# Altium schematic sheet gateway.SchDoc
size A
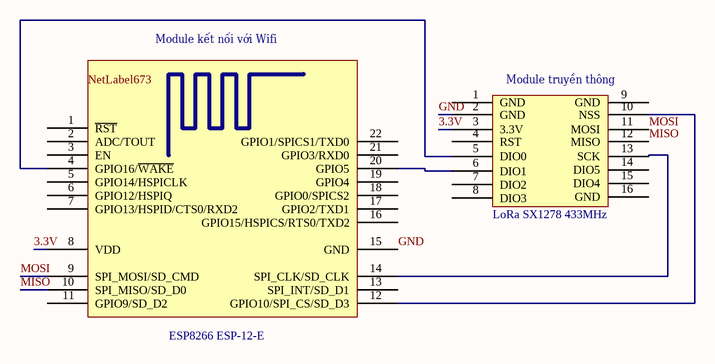
[diagram p0: gateway.SchDoc]

## Parts
Module_kết_nối_với_Wifi  ESP8266 ESP-12-E  [ESP8266 ESP-12-E]
Module_truyền_thông  LoRa SX1278 433MHz  [PCBLoRa]

## Nets
3.3V: Module_kết_nối_với_Wifi.8(VDD) Module_truyền_thông.3(3.3V)
GND: Module_kết_nối_với_Wifi.15(GND) Module_truyền_thông.2(GND)
MISO: Module_kết_nối_với_Wifi.10(SPI_MISO/SD_D0) Module_truyền_thông.12(MISO)
MOSI: Module_kết_nối_với_Wifi.9(SPI_MOSI/SD_CMD) Module_truyền_thông.11(MOSI)
NetModule_kết_nối_với_Wifi_4: Module_kết_nối_với_Wifi.4(GPIO16/~{WAKE}) Module_truyền_thông.5(DIO0)
NetModule_kết_nối_với_Wifi_12: Module_kết_nối_với_Wifi.12(GPIO10/SPI_CS/SD_D3) Module_truyền_thông.10(NSS)
NetModule_kết_nối_với_Wifi_14: Module_kết_nối_với_Wifi.14(SPI_CLK/SD_CLK) Module_truyền_thông.13(SCK)
NetModule_kết_nối_với_Wifi_20: Module_kết_nối_với_Wifi.20(GPIO5) Module_truyền_thông.6(DIO1)

Not connected (* = marked no-connect by the designer): Module_kết_nối_với_Wifi 1(~{RST}) 2(ADC/TOUT) 3(EN) 5(GPIO14/HSPICLK) 6(GPIO12/HSPIQ) 7(GPIO13/HSPID/CTS0/RXD2) 11(GPIO9/SD_D2) 13(SPI_INT/SD_D1) 16(GPIO15/HSPICS/RTS0/TXD2) 17(GPIO2/TXD1) 18(GPIO0/SPICS2) 19(GPIO4) 21(GPIO3/RXD0) 22(GPIO1/SPICS1/TXD0); Module_truyền_thông 1(GND) 4(RST) 7(DIO2) 8(DIO3) 9(GND) 14(DIO5) 15(DIO4) 16(GND)

## Notes on the sheet
- Labels drawn without touching a wire or pin: NetLabel673

## Library data of the parts
Module_truyền_thông = Component_1